# EAGLE schematic ArmazCape - Rev B3 (EAGLE 7.5.0)

## Sheet 1 of 3
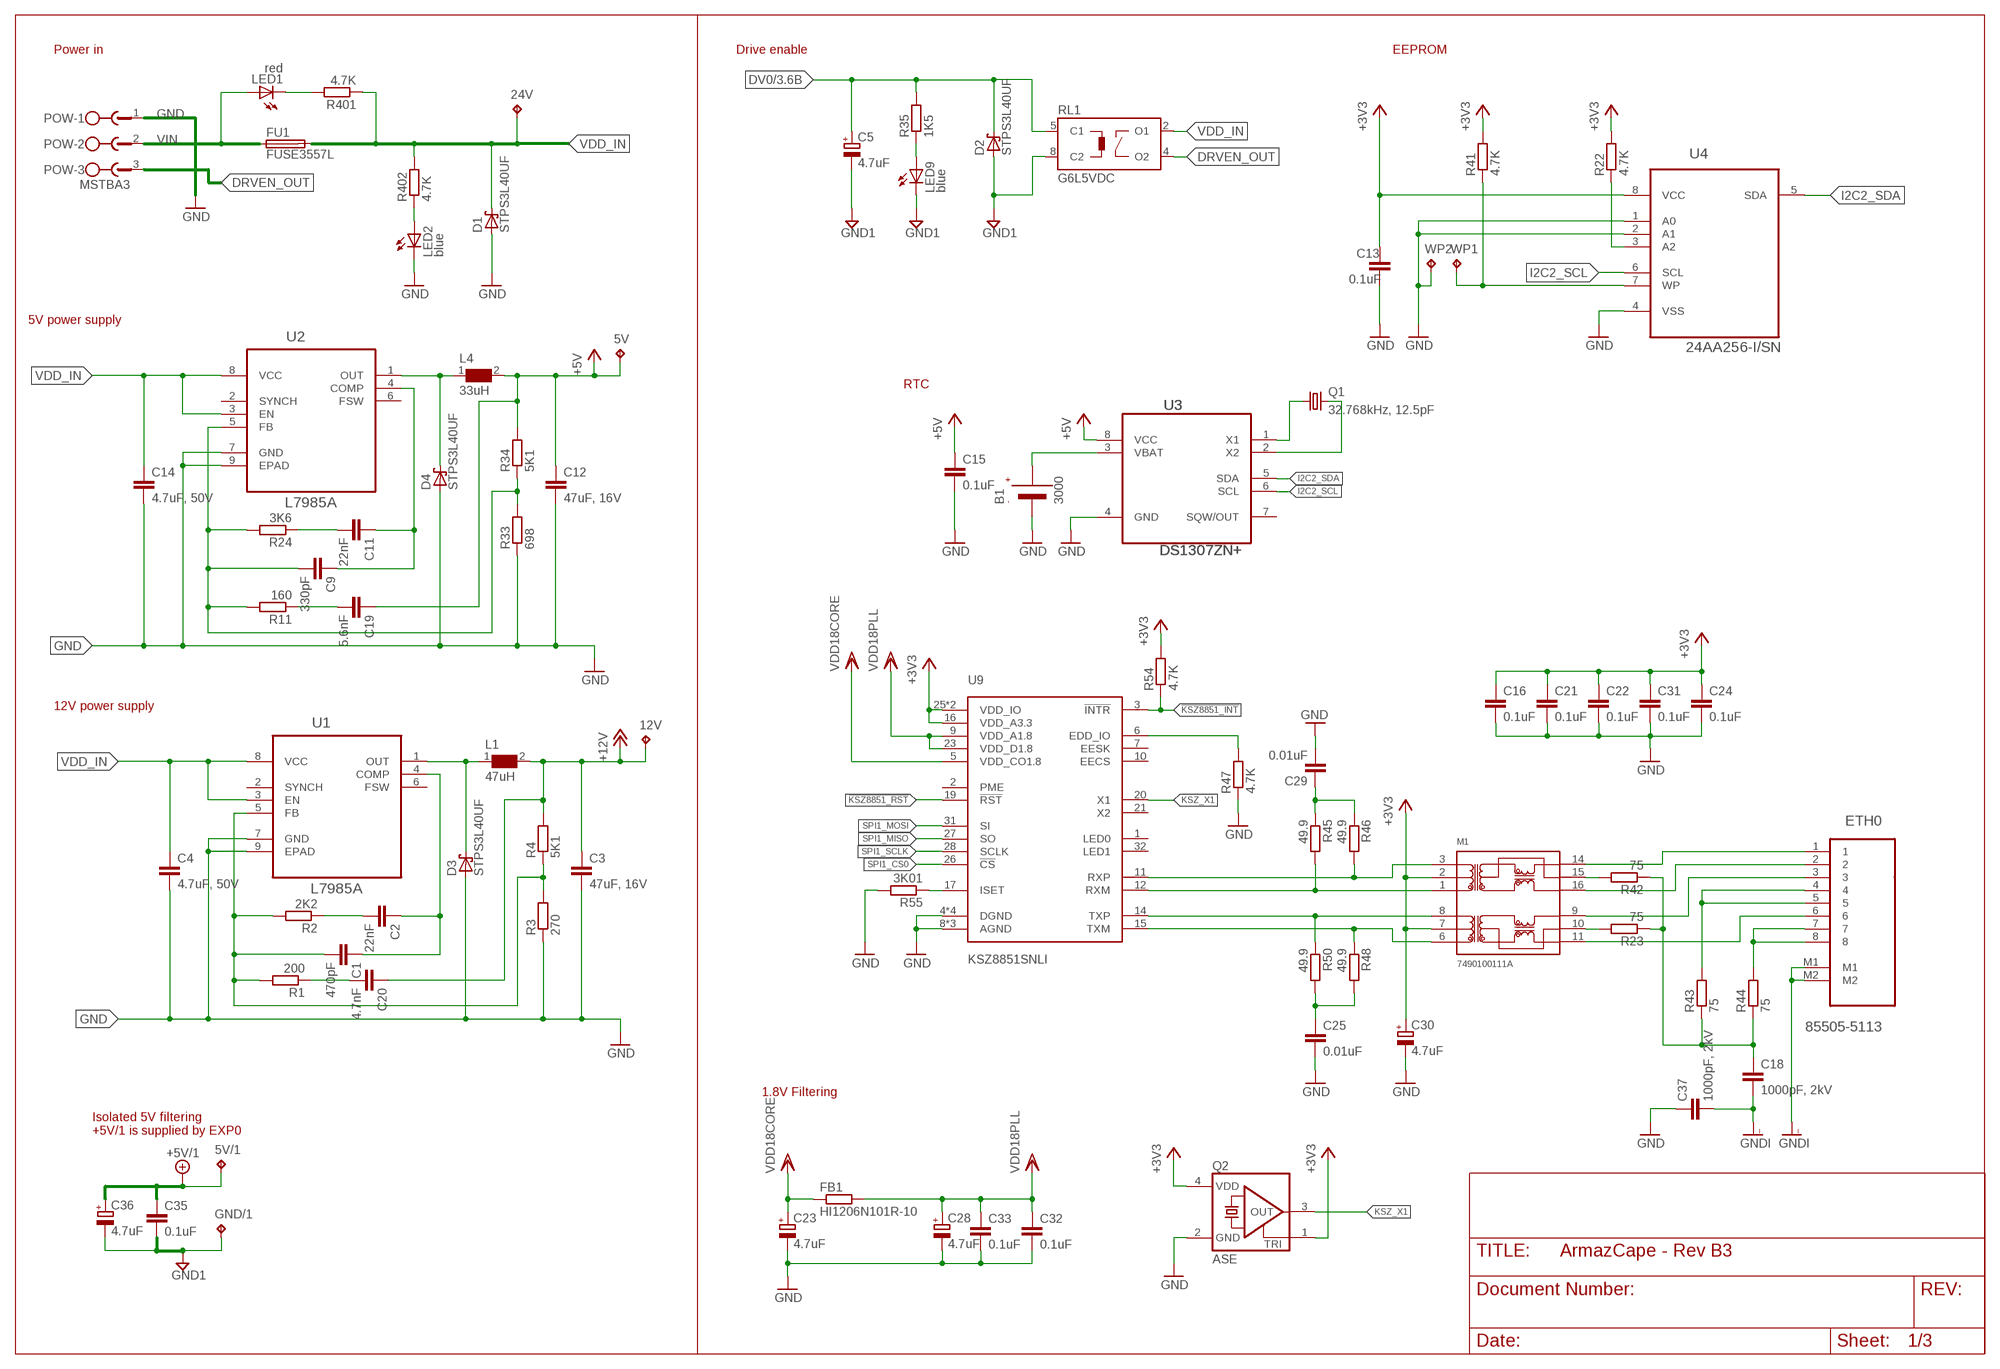
[diagram p0: schematic, sheet 1]

### Parts
5V  TPB1,27  [B1,27]
5V/1  TPB1,27  [B1,27]
12V  TPB1,27  [B1,27]
24V  TPB1,27  [B1,27]
B1  3000  [3000]
C1  470pF  C-EUC0603  [C0603]
C2  22nF  C-EUC0603  [C0603]
C3  47uF, 16V  C-EUC1210  [C1210]
C4  4.7uF, 50V  C-EUC1210  [C1210]
C5  4.7uF  CPOL-EUCT3216  [CT3216]
C9  330pF  C-EUC0603  [C0603]
C11  22nF  C-EUC0603  [C0603]
C12  47uF, 16V  C-EUC1210  [C1210]
C13  0.1uF  C-EUC0603  [C0603]
C14  4.7uF, 50V  C-EUC1210  [C1210]
C15  0.1uF  C-EUC0603  [C0603]
C16  0.1uF  C-EUC0603  [C0603]
C18  1000pF, 2kV  C-EUC1206  [C1206]
C19  5.6nF  C-EUC0603  [C0603]
C20  4.7nF  C-EUC0603  [C0603]
C21  0.1uF  C-EUC0603  [C0603]
C22  0.1uF  C-EUC0603  [C0603]
C23  4.7uF  CPOL-EUCT3216  [CT3216]
C24  0.1uF  C-EUC0603  [C0603]
C25  0.01uF  C-EUC0603  [C0603]
C28  4.7uF  CPOL-EUCT3216  [CT3216]
C29  0.01uF  C-EUC0603  [C0603]
C30  4.7uF  CPOL-EUCT3216  [CT3216]
C31  0.1uF  C-EUC0603  [C0603]
C32  0.1uF  C-EUC0603  [C0603]
C33  0.1uF  C-EUC0603  [C0603]
C35  0.1uF  C-EUC0603  [C0603]
C36  4.7uF  CPOL-EUCT3216  [CT3216]
C37  1000pF, 2kV  C-EUC1206  [C1206]
D1  STPS3L40UF  [SMB]
D2  STPS3L40UF  [SMB]
D3  STPS3L40UF  [SMB]
D4  STPS3L40UF  [SMB]
ETH0  85505-5113  [MOLEX_85505-5113]
FB1  HI1206N101R-10  [1206]
FU1  FUSE3557L  [3557-LITTLE]
GND/1  TPB1,27  [B1,27]
L1  47uH  WE-PD-7447709470_1260/1245/1280/1210  [WE-PD_1260/1245/1280/1210]
L4  33uH  WE-PD-7447709330_1260/1245/1280/1210  [WE-PD_1260/1245/1280/1210]
LED1  red  LEDCHIP-LED0603  [CHIP-LED0603]
LED2  blue  LEDCHIP-LED0603  [CHIP-LED0603]
LED9  blue  LEDCHIP-LED0603  [CHIP-LED0603]
M1  7490100111A  [7490100]
POW  MSTBA3  [MSTBA3]
Q1  32.768kHz, 12.5pF  ABS07-32.768KHZ  [ABS07]
Q2  ASE  [ASE]
R1  200  R-EU_R0603  [R0603]
R2  2K2  R-EU_R0603  [R0603]
R3  270  R-EU_R0603  [R0603]
R4  5K1  R-EU_R0603  [R0603]
R11  160  R-EU_R0402  [R0402]
R22  4.7K  R-EU_R0603  [R0603]
R23  75  R-EU_R0603  [R0603]
R24  3K6  R-EU_R0603  [R0603]
R33  698  R-EU_R0603  [R0603]
R34  5K1  R-EU_R0603  [R0603]
R35  1K5  R-EU_R0603  [R0603]
R41  4.7K  R-EU_R0603  [R0603]
R42  75  R-EU_R0603  [R0603]
R43  75  R-EU_R0603  [R0603]
R44  75  R-EU_R0603  [R0603]
R45  49.9  R-EU_R0603  [R0603]
R46  49.9  R-EU_R0603  [R0603]
R47  4.7K  R-EU_R0603  [R0603]
R48  49.9  R-EU_R0603  [R0603]
R50  49.9  R-EU_R0603  [R0603]
R54  4.7K  R-EU_R0603  [R0603]
R55  3K01  R-EU_R0603  [R0603]
R401  4.7K  R-EU_R0603  [R0603]
R402  4.7K  R-EU_R0603  [R0603]
RL1  G6L5VDC  [G6L-1F]
U1  L7985A  [SOIC127P600X170-9N]
U2  L7985A  [SOIC127P600X170-9N]
U3  DS1307ZN+  MAXIM_DS1307ZN+  [MAXIM_SOIC127P600X175-8N]
U4  24AA256-I/SN  MICROCHIP_BY_ELEMENT14_BATCH_1_24AA256-I/SN  [MICROCHIP_BY_ELEMENT14_BATCH_1_SOIC127P600X175-8N]
U9  KSZ8851SNLI  [QFN50P500X500X85-32L]
WP1  TPB1,27  [B1,27]
WP2  TPB1,27  [B1,27]

### Nets
!KSZ8851_INT: R54.1 U9.3(!INTR) ; also sheet 2
!KSZ8851_RST: U9.19(!RST) ; also sheet 2
+3V3 [supply]: C13.1 C16.1 C21.1 C22.1 C24.1 C30.+ C31.1 M1.2(RXCTI) M1.7(TXCTI) Q2.1(TRI) Q2.4(VDD) R22.2 R41.2 R54.2 U4.8(VCC) U9.25(VDD_IO) U9.30(VDD_IO) ; also sheet 2,3
+5V [supply]: 5V.TP C12.1 C15.1 C19.1 L4.2 R34.2 U3.8(VCC) ; also sheet 2,3
+5V/1 [supply]: 5V/1.TP C35.1 C36.+ ; also sheet 3
+12V [supply]: 12V.TP C3.1 C20.1 L1.2 R4.2 ; also sheet 2,3
DRVEN_OUT [supply]: POW.3 RL1.4(O2)
DV0: C5.+ D2.C R35.2 RL1.5(C1) ; also sheet 3
GND [supply]: B1.-(VBAT-) C3.2 C4.2 C12.2 C13.2 C14.2 C15.2 C16.2 C21.2 C22.2 C23.- C24.2 C25.2 C28.- C29.2 C30.- C31.2 C32.2 C33.2 C37.1 D1.A D3.A D4.A LED2.C POW.1 Q2.2(GND) R3.1 R33.1 R47.1 R55.2 U1.7(GND) U1.9(EPAD) U2.7(GND) U2.9(EPAD) U3.4(GND) U4.1(A0) U4.2(A1) U4.4(VSS) U9.4(DGND) U9.8(AGND) U9.13(AGND) U9.18(AGND) U9.22(DGND) U9.24(DGND) U9.29(DGND) WP2.TP ; also sheet 2,3
GND1 [supply]: C5.- C35.2 C36.- D2.A GND/1.TP LED9.C RL1.8(C2) ; also sheet 3
GNDI [supply]: C18.2 C37.2 ETH0.M1 ETH0.M2
I2C2_SCL: U3.6(SCL) U4.6(SCL) ; also sheet 2,3
I2C2_SDA: U3.5(SDA) U4.5(SDA) ; also sheet 2,3
KSZ_X1: Q2.3(OUT) U9.20(X1)
N$1 [supply]: C1.2 R1.2 R2.2 R3.2 R4.1 U1.5(FB)
N$2: C2.2 R2.1
N$3: C1.1 C2.1 U1.4(COMP)
N$4: M1.3(RDIP) R46.2 U9.11(RXP)
N$6: ETH0.6 M1.11(TDOM)
N$7: LED9.A R35.1
N$8: LED1.C R401.2
N$19 [supply]: D4.C L4.1 U2.1(OUT)
N$21 [supply]: C9.2 R11.2 R24.2 R33.2 R34.1 U2.5(FB)
N$24: Q1.1 U3.1(X1)
N$26: Q1.2 U3.2(X2)
N$28: C11.2 R24.1
N$29: C9.1 C11.1 U2.4(COMP)
N$30 [supply]: D3.C L1.1 U1.1(OUT)
N$31: M1.1(RDIM) R45.2 U9.12(RXM)
N$32: C19.2 R11.1
N$33: C20.2 R1.1
N$34: R41.1 U4.7(WP) WP1.TP
N$35: R22.1 U4.3(A2)
N$36: M1.8(TDIP) R50.1 U9.14(TXP)
N$37: M1.6(TDIM) R48.1 U9.15(TXM)
N$38: R55.1 U9.17(ISET)
N$40: ETH0.1 M1.14(RXOP)
N$41: ETH0.2 M1.16(RDOM)
N$42: ETH0.3 M1.9(TDOP)
N$43: C25.1 R48.2 R50.2
N$44: M1.10(TXCTO) R23.2
N$45: M1.15(RXCTO) R42.2
N$46: ETH0.4 ETH0.5 R43.2
N$47: ETH0.7 ETH0.8 R44.2
N$48: C18.1 R23.1 R42.1 R43.1 R44.1
N$49: C29.1 R45.1 R46.1
N$52: R47.2 U9.6(EDD_IO)
N$96: LED2.A R402.1
SPI1_CS0: U9.26(!CS) ; also sheet 2
SPI1_MISO: U9.27(SO) ; also sheet 2
SPI1_MOSI: U9.31(SI) ; also sheet 2
SPI1_SCLK: U9.28(SCLK) ; also sheet 2
VBAT+ [supply]: B1.+1(VBAT+) B1.+2(VBAT+) U3.3(VBAT)
VDD18CORE: C23.+ FB1.1 U9.5(VDD_CO1.8)
VDD18PLL: C28.+ C32.1 C33.1 FB1.2 U9.9(VDD_A1.8) U9.23(VDD_D1.8)
VDD_IN [supply]: 24V.TP C4.1 C14.1 D1.C FU1.3 FU1.4 R401.1 R402.2 RL1.2(O1) U1.3(EN) U1.8(VCC) U2.3(EN) U2.8(VCC)
VIN [supply]: FU1.1 FU1.2 LED1.A POW.2
Unconnected: U1.2(SYNCH) U1.6(FSW) U2.2(SYNCH) U2.6(FSW) U3.7(SQW/OUT) U9.1(LED0) U9.2(PME) U9.7(EESK) U9.10(EECS) U9.21(X2) U9.32(LED1)

### Notes on the sheet
- Power in | Drive enable | EEPROM
- 5V power supply
- RTC
- 12V power supply
- 1.8V Filtering
- Isolated 5V filtering
  +5V/1 is supplied by EXP0

## Sheet 2 of 3
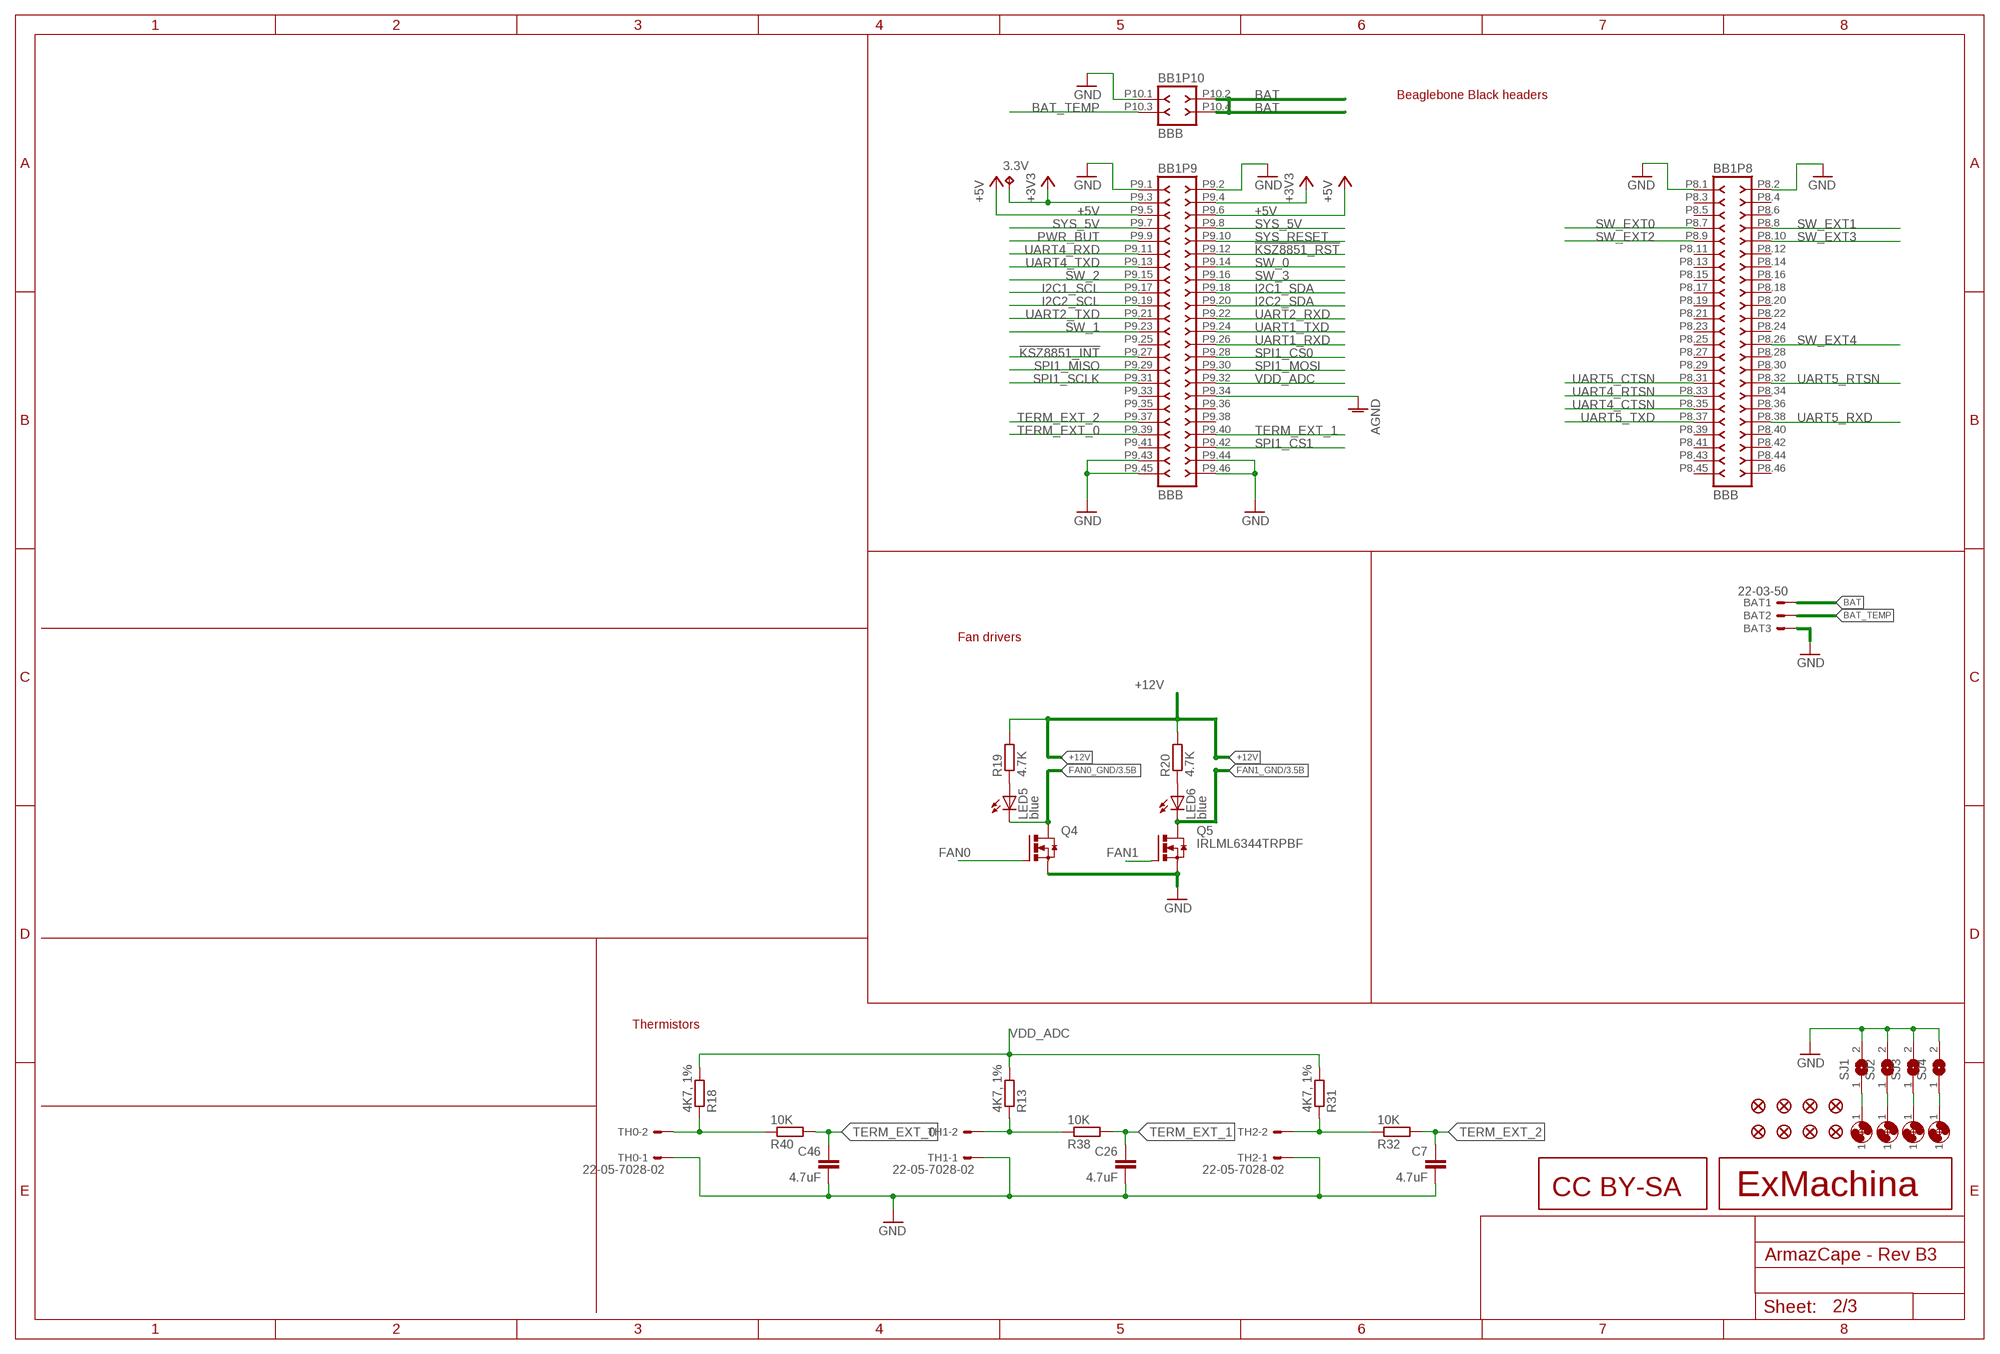
[diagram p1: schematic, sheet 2]

### Parts
3.3V  TPB1,27  [B1,27]
BAT  22-03-50  [5267-02A]
BB1  BBB  [BBB]
C7  4.7uF  C-EUC0603  [C0603]
C26  4.7uF  C-EUC0603  [C0603]
C46  4.7uF  C-EUC0603  [C0603]
FI1  FIDUCIAL1X2  [FIDUCIAL-1X2]
FI2  FIDUCIAL1X2  [FIDUCIAL-1X2]
FI3  FIDUCIAL1X2  [FIDUCIAL-1X2]
FI4  FIDUCIAL1X2  [FIDUCIAL-1X2]
FI5  FIDUCIAL1X2  [FIDUCIAL-1X2]
FI6  FIDUCIAL1X2  [FIDUCIAL-1X2]
FI7  FIDUCIAL1X2  [FIDUCIAL-1X2]
FI8  FIDUCIAL1X2  [FIDUCIAL-1X2]
H1  MOUNT-PAD3,0  [P3,0]
H2  MOUNT-PAD3,0  [P3,0]
H3  MOUNT-PAD3,0  [P3,0]
H4  MOUNT-PAD3,0  [P3,0]
LED5  blue  LEDCHIP-LED0603  [CHIP-LED0603]
LED6  blue  LEDCHIP-LED0603  [CHIP-LED0603]
Q4  IRLML6344TRPBF  [SOT95P240X112-3N]
Q5  IRLML6344TRPBF  [SOT95P240X112-3N]
R13  4K7, 1%  R-EU_R0603  [R0603]
R18  4K7, 1%  R-EU_R0603  [R0603]
R19  4.7K  R-EU_R0603  [R0603]
R20  4.7K  R-EU_R0603  [R0603]
R31  4K7, 1%  R-EU_R0603  [R0603]
R32  10K  R-EU_R0603  [R0603]
R38  10K  R-EU_R0603  [R0603]
R40  10K  R-EU_R0603  [R0603]
SJ1  SJ  [SJ]
SJ2  SJ  [SJ]
SJ3  SJ  [SJ]
SJ4  SJ  [SJ]
TH0  22-05-7028-02  [7395-02]
TH1  22-05-7028-02  [7395-02]
TH2  22-05-7028-02  [7395-02]
U$1  EXMACHINA-LOGO-NAME  [EXM-LOGO-BASELINE]
U$2  CC-BY-SA  [CC-BY-SA]

### Nets
!KSZ8851_INT: BB1.P9.27 ; also sheet 1
!KSZ8851_RST: BB1.P9.12 ; also sheet 1
+3V3 [supply]: 3.3V.TP BB1.P9.3 BB1.P9.4 ; also sheet 1,3
+5V [supply]: BB1.P9.5 BB1.P9.6 ; also sheet 1,3
+12V [supply]: R19.2 R20.2 ; also sheet 1,3
AGND: BB1.P9.34
BAT [supply]: BAT.P1 BB1.P10.2 BB1.P10.4
BAT_TEMP: BAT.P2 BB1.P10.3
FAN0: Q4.1(G) ; also sheet 3
FAN0_GND [supply]: LED5.C Q4.3(D) ; also sheet 3
FAN1: Q5.1(G) ; also sheet 3
FAN1_GND [supply]: LED6.C Q5.3(D) ; also sheet 3
GND [supply]: BAT.P3 BB1.P8.1 BB1.P8.2 BB1.P9.1 BB1.P9.2 BB1.P9.43 BB1.P9.44 BB1.P9.45 BB1.P9.46 BB1.P10.1 C7.2 C26.2 C46.2 Q4.2(S) Q5.2(S) SJ1.2 SJ2.2 SJ3.2 SJ4.2 TH0.1 TH1.1 TH2.1 ; also sheet 1,3
I2C1_SCL: BB1.P9.17
I2C1_SDA: BB1.P9.18
I2C2_SCL: BB1.P9.19 ; also sheet 1,3
I2C2_SDA: BB1.P9.20 ; also sheet 1,3
N$9: LED5.A R19.1
N$25: R31.1 R32.1 TH2.2
N$101 [supply]: H4.1 SJ1.1
N$102 [supply]: H3.1 SJ2.1
N$103 [supply]: H2.1 SJ3.1
N$104 [supply]: H1.1 SJ4.1
N$117: LED6.A R20.1
N$237: R13.1 R38.1 TH1.2
N$240: R18.1 R40.1 TH0.2
PWR_BUT: BB1.P9.9
SPI1_CS0: BB1.P9.28 ; also sheet 1
SPI1_CS1: BB1.P9.42
SPI1_MISO: BB1.P9.29 ; also sheet 1
SPI1_MOSI: BB1.P9.30 ; also sheet 1
SPI1_SCLK: BB1.P9.31 ; also sheet 1
SW_0: BB1.P9.14 ; also sheet 3
SW_1: BB1.P9.23 ; also sheet 3
SW_2: BB1.P9.15 ; also sheet 3
SW_3: BB1.P9.16 ; also sheet 3
SW_EXT0: BB1.P8.7 ; also sheet 3
SW_EXT1: BB1.P8.8 ; also sheet 3
SW_EXT2: BB1.P8.9 ; also sheet 3
SW_EXT3: BB1.P8.10 ; also sheet 3
SW_EXT4: BB1.P8.26 ; also sheet 3
SYS_5V [supply]: BB1.P9.7 BB1.P9.8 ; also sheet 3
SYS_RESET: BB1.P9.10
TERM_EXT_0: BB1.P9.39 C46.1 R40.2
TERM_EXT_1: BB1.P9.40 C26.1 R38.2
TERM_EXT_2: BB1.P9.37 C7.1 R32.2
UART1_RXD: BB1.P9.26
UART1_TXD: BB1.P9.24
UART2_RXD: BB1.P9.22
UART2_TXD: BB1.P9.21
UART4_CTSN: BB1.P8.35
UART4_RTSN: BB1.P8.33
UART4_RXD: BB1.P9.11 ; also sheet 3
UART4_TXD: BB1.P9.13
UART5_CTSN: BB1.P8.31
UART5_RTSN: BB1.P8.32
UART5_RXD: BB1.P8.38 ; also sheet 3
UART5_TXD: BB1.P8.37 ; also sheet 3
VDD_ADC: BB1.P9.32 R13.2 R18.2 R31.2
Unconnected: BB1.P8.3 BB1.P8.4 BB1.P8.5 BB1.P8.6 BB1.P8.11 BB1.P8.12 BB1.P8.13 BB1.P8.14 BB1.P8.15 BB1.P8.16 BB1.P8.17 BB1.P8.18 BB1.P8.19 BB1.P8.20 BB1.P8.21 BB1.P8.22 BB1.P8.23 BB1.P8.24 BB1.P8.25 BB1.P8.27 BB1.P8.28 BB1.P8.29 BB1.P8.30 BB1.P8.34 BB1.P8.36 BB1.P8.39 BB1.P8.40 BB1.P8.41 BB1.P8.42 BB1.P8.43 BB1.P8.44 BB1.P8.45 BB1.P8.46 BB1.P9.25 BB1.P9.33 BB1.P9.35 BB1.P9.36 BB1.P9.38 BB1.P9.41

### Notes on the sheet
- Beaglebone Black headers
- Fan drivers
- Thermistors

## Sheet 3 of 3
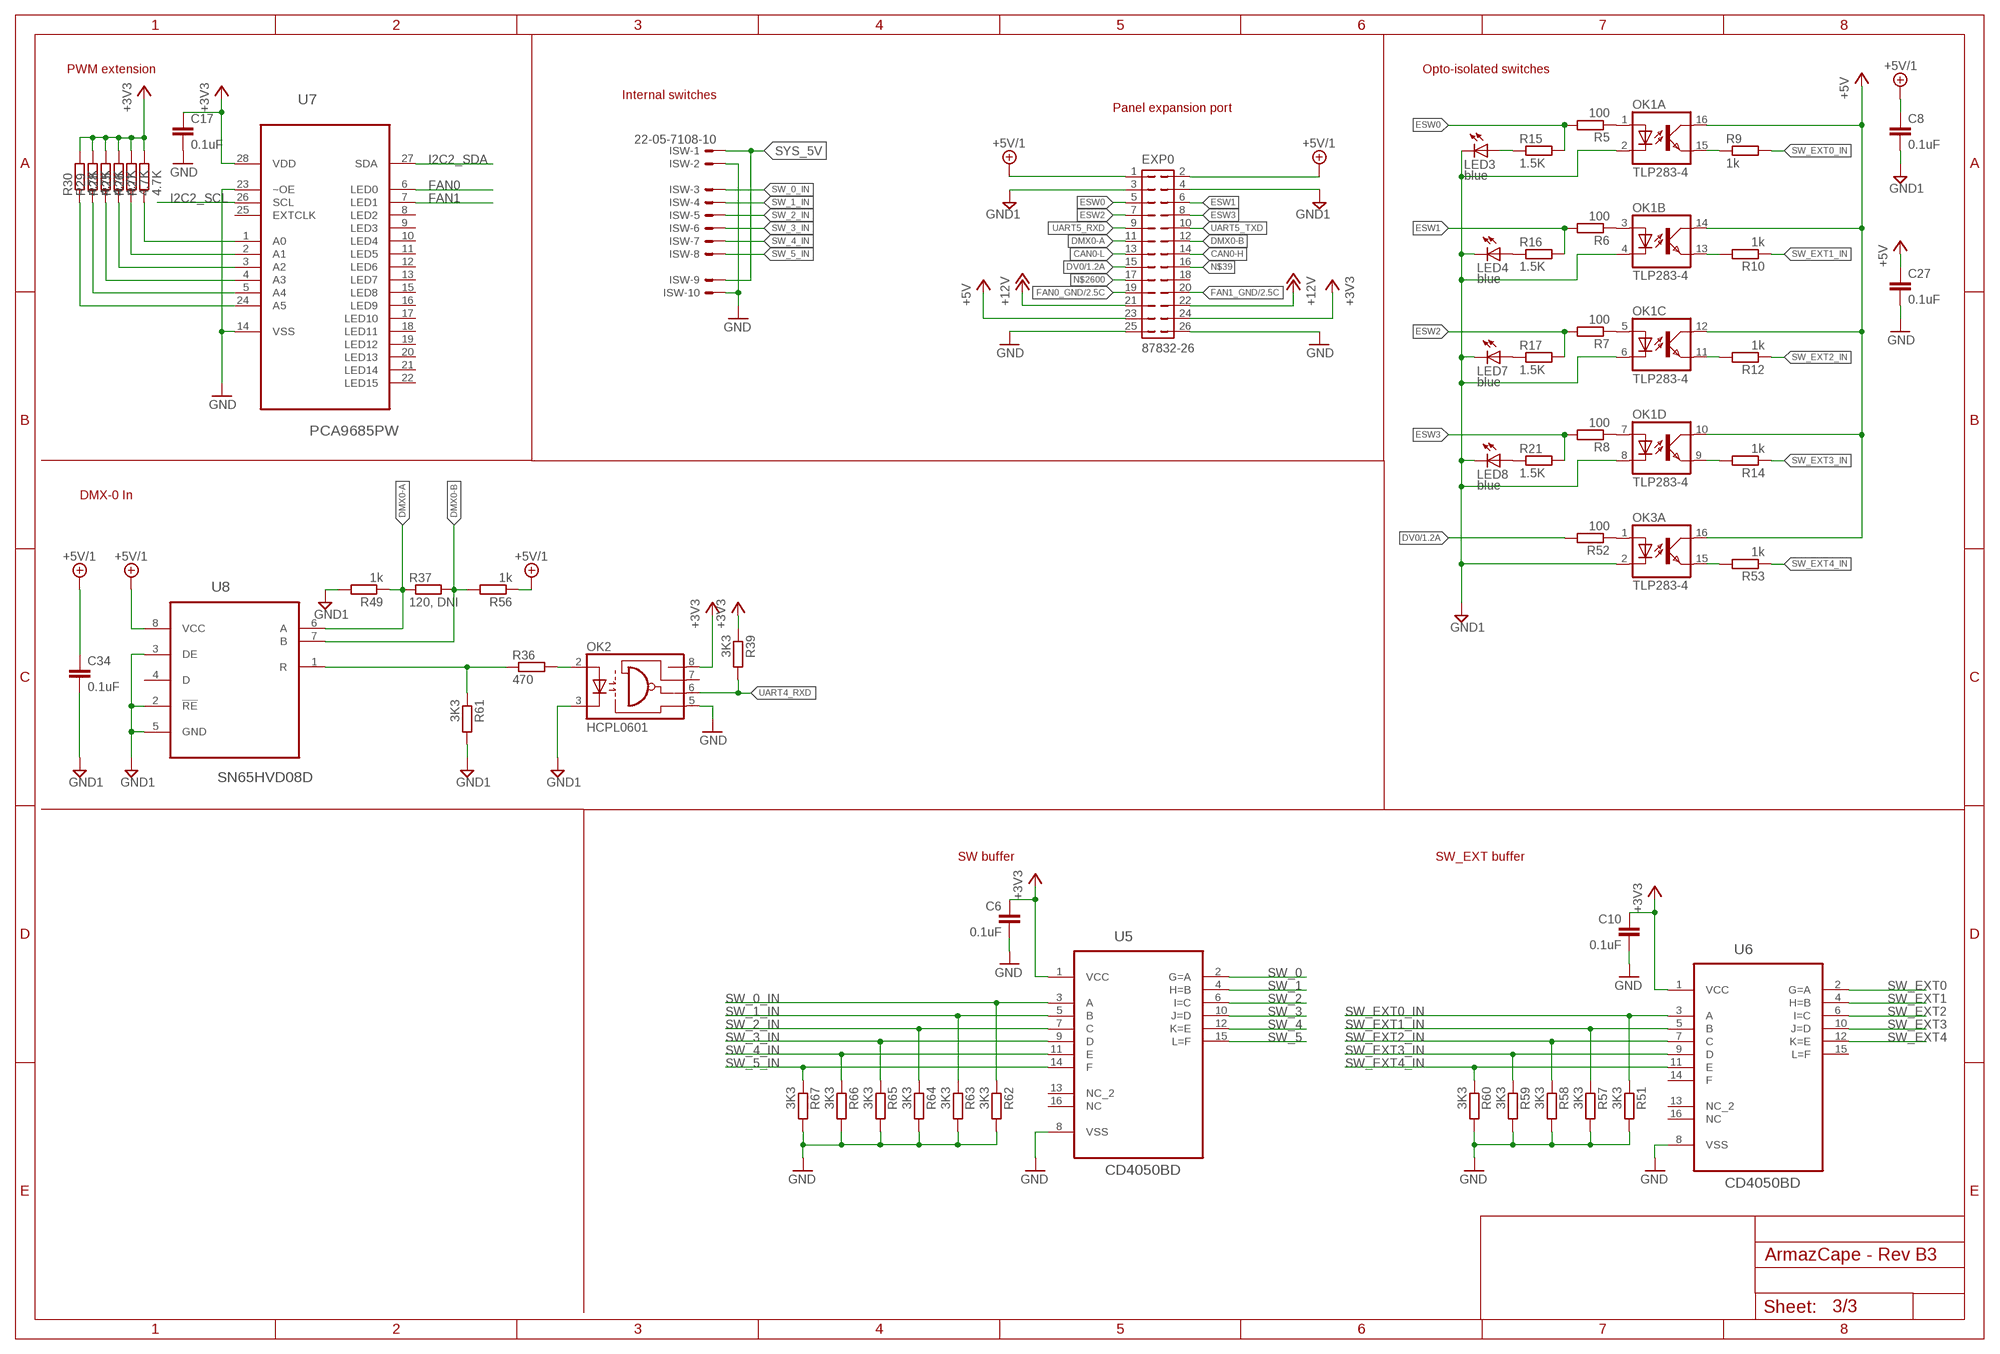
[diagram p2: schematic, sheet 3]

### Parts
C6  0.1uF  C-EUC0603  [C0603]
C8  0.1uF  C-EUC0603  [C0603]
C10  0.1uF  C-EUC0603  [C0603]
C17  0.1uF  C-EUC0603  [C0603]
C27  0.1uF  C-EUC0603  [C0603]
C34  0.1uF  C-EUC0603  [C0603]
EXP0  87832-26  [87832-26]
ISW  22-05-7108-10  [7395-10]
LED3  blue  LEDCHIP-LED0603  [CHIP-LED0603]
LED4  blue  LEDCHIP-LED0603  [CHIP-LED0603]
LED7  blue  LEDCHIP-LED0603  [CHIP-LED0603]
LED8  blue  LEDCHIP-LED0603  [CHIP-LED0603]
OK1  TLP283-4  [MINI-FLAT-16]
OK2  HCPL0601  [SOIC08]
OK3  TLP283-4  [MINI-FLAT-16]
R5  100  R-EU_R0603  [R0603]
R6  100  R-EU_R0603  [R0603]
R7  100  R-EU_R0603  [R0603]
R8  100  R-EU_R0603  [R0603]
R9  1k  R-EUR0603  [R0603]
R10  1k  R-EUR0603  [R0603]
R12  1k  R-EUR0603  [R0603]
R14  1k  R-EUR0603  [R0603]
R15  1.5K  R-EU_R0603  [R0603]
R16  1.5K  R-EU_R0603  [R0603]
R17  1.5K  R-EU_R0603  [R0603]
R21  1.5K  R-EU_R0603  [R0603]
R25  4.7K  R-EU_R0603  [R0603]
R26  4.7K  R-EU_R0603  [R0603]
R27  4.7K  R-EU_R0603  [R0603]
R28  4.7K  R-EU_R0603  [R0603]
R29  4.7K  R-EU_R0603  [R0603]
R30  4.7K  R-EU_R0603  [R0603]
R36  470  R-EU_R0603  [R0603]
R37  120, DNI  R-EU_R0603  [R0603]
R39  3K3  R-EU_R0603  [R0603]
R49  1k  R-EUR0603  [R0603]
R51  3K3  R-EU_R0603  [R0603]
R52  100  R-EU_R0603  [R0603]
R53  1k  R-EUR0603  [R0603]
R56  1k  R-EUR0603  [R0603]
R57  3K3  R-EU_R0603  [R0603]
R58  3K3  R-EU_R0603  [R0603]
R59  3K3  R-EU_R0603  [R0603]
R60  3K3  R-EU_R0603  [R0603]
R61  3K3  R-EU_R0603  [R0603]
R62  3K3  R-EU_R0603  [R0603]
R63  3K3  R-EU_R0603  [R0603]
R64  3K3  R-EU_R0603  [R0603]
R65  3K3  R-EU_R0603  [R0603]
R66  3K3  R-EU_R0603  [R0603]
R67  3K3  R-EU_R0603  [R0603]
U5  CD4050BD  [SOIC127P600X175-16N]
U6  CD4050BD  [SOIC127P600X175-16N]
U7  PCA9685PW  [SOP65P640X110-28N]
U8  SN65HVD08D  [SOIC127P600X175-8N]

### Nets
+3V3 [supply]: C6.1 C10.1 C17.1 EXP0.24 OK2.8(VCC) R25.2 R26.2 R27.2 R28.2 R29.2 R30.2 R39.1 U5.1(VCC) U6.1(VCC) U7.28(VDD) ; also sheet 1,2
+5V [supply]: C27.1 EXP0.23 OK1.10(D:COL) OK1.12(C:COL) OK1.14(B:COL) OK1.16(A:COL) OK3.16(A:COL) ; also sheet 1,2
+5V/1 [supply]: C8.1 C34.1 EXP0.1 EXP0.2 R56.1 U8.8(VCC) ; also sheet 1
+12V [supply]: EXP0.21 EXP0.22 ; also sheet 1,2
CAN0-H: EXP0.14
CAN0-L: EXP0.13
DMX0-A: EXP0.11 R37.1 R49.1 U8.6(A)
DMX0-B: EXP0.12 R37.2 R56.2 U8.7(B)
DV0: EXP0.15 R52.2 ; also sheet 1
ESW0: EXP0.5 R5.2 R15.2
ESW1: EXP0.6 R6.2 R16.2
ESW2: EXP0.7 R7.2 R17.2
ESW3: EXP0.8 R8.2 R21.2
FAN0: U7.6(LED0) ; also sheet 2
FAN0_GND [supply]: EXP0.19 ; also sheet 2
FAN1: U7.7(LED1) ; also sheet 2
FAN1_GND [supply]: EXP0.20 ; also sheet 2
GND [supply]: C6.2 C10.2 C17.2 C27.2 EXP0.25 EXP0.26 ISW.2 ISW.10 OK2.5(GND) R51.2 R57.2 R58.2 R59.2 R60.2 R62.2 R63.2 R64.2 R65.2 R66.2 R67.2 U5.8(VSS) U6.8(VSS) U7.14(VSS) U7.23(~OE) ; also sheet 1,2
GND1 [supply]: C8.2 C34.2 EXP0.3 EXP0.4 LED3.C LED4.C LED7.C LED8.C OK1.2(A:C) OK1.4(B:C) OK1.6(C:C) OK1.8(D:C) OK2.3(C) OK3.2(A:C) R49.2 R61.2 U8.2(!RE) U8.3(DE) U8.5(GND) ; also sheet 1
I2C2_SCL: U7.26(SCL) ; also sheet 1,2
I2C2_SDA: U7.27(SDA) ; also sheet 1,2
N$5 [supply]: OK2.2(A) R36.2
N$10: OK1.1(A:A) R5.1
N$11: OK1.15(A:EMIT) R9.1
N$12: OK1.7(D:A) R8.1
N$13: OK1.9(D:EMIT) R14.2
N$14: OK1.11(C:EMIT) R12.2
N$15: OK1.13(B:EMIT) R10.2
N$16: LED3.A R15.1
N$17: OK1.3(B:A) R6.1
N$18: LED4.A R16.1
N$20: LED7.A R17.1
N$22: LED8.A R21.1
N$23: OK1.5(C:A) R7.1
N$27: R36.1 R61.1 U8.1(R)
N$39: EXP0.16
N$53: OK3.1(A:A) R52.1
N$54: OK3.15(A:EMIT) R53.2
N$58: R27.1 U7.1(A0)
N$59: R26.1 U7.2(A1)
N$76: R25.1 U7.3(A2)
N$94: R28.1 U7.4(A3)
N$95: R29.1 U7.5(A4)
N$112: R30.1 U7.24(A5)
N$2600: EXP0.17
SW_0: U5.2(G=A) ; also sheet 2
SW_0_IN: ISW.3 R62.1 U5.3(A)
SW_1: U5.4(H=B) ; also sheet 2
SW_1_IN: ISW.4 R63.1 U5.5(B)
SW_2: U5.6(I=C) ; also sheet 2
SW_2_IN: ISW.5 R64.1 U5.7(C)
SW_3: U5.10(J=D) ; also sheet 2
SW_3_IN: ISW.6 R65.1 U5.9(D)
SW_4: U5.12(K=E)
SW_4_IN: ISW.7 R66.1 U5.11(E)
SW_5: U5.15(L=F)
SW_5_IN: ISW.8 R67.1 U5.14(F)
SW_EXT0: U6.2(G=A) ; also sheet 2
SW_EXT0_IN: R9.2 R51.1 U6.3(A)
SW_EXT1: U6.4(H=B) ; also sheet 2
SW_EXT1_IN: R10.1 R57.1 U6.5(B)
SW_EXT2: U6.6(I=C) ; also sheet 2
SW_EXT2_IN: R12.1 R58.1 U6.7(C)
SW_EXT3: U6.10(J=D) ; also sheet 2
SW_EXT3_IN: R14.1 R59.1 U6.9(D)
SW_EXT4: U6.12(K=E) ; also sheet 2
SW_EXT4_IN: R53.1 R60.1 U6.11(E)
SYS_5V [supply]: ISW.1 ISW.9 ; also sheet 2
UART4_RXD: OK2.6(VO) R39.2 ; also sheet 2
UART5_RXD: EXP0.9 ; also sheet 2
UART5_TXD: EXP0.10 ; also sheet 2
Unconnected: EXP0.18 OK2.7(VE) OK3.3(B:A) OK3.4(B:C) OK3.5(C:A) OK3.6(C:C) OK3.7(D:A) OK3.8(D:C) OK3.9(D:EMIT) OK3.10(D:COL) OK3.11(C:EMIT) OK3.12(C:COL) OK3.13(B:EMIT) OK3.14(B:COL) U5.13(NC_2) U5.16(NC) U6.13(NC_2) U6.14(F) U6.15(L=F) U6.16(NC) U7.8(LED2) U7.9(LED3) U7.10(LED4) U7.11(LED5) U7.12(LED6) U7.13(LED7) U7.15(LED8) U7.16(LED9) U7.17(LED10) U7.18(LED11) U7.19(LED12) U7.20(LED13) U7.21(LED14) U7.22(LED15) U7.25(EXTCLK) U8.4(D)

### Notes on the sheet
- PWM extension | Opto-isolated switches
- Internal switches
- Panel expansion port
- DMX-0 In
- SW buffer | SW_EXT buffer

## Power pins joined to a net without a drawn wire
VDD_A3.3: U9.16(VDD_A3.3)

## Library data of the parts
3.3V 5V 5V/1 12V 24V GND/1 WP1 WP2 = testpad:TP: Test pad; OC_FARNELL: unknown
B1 = keystone:3000; MF: KEYSTONE; MPN: 3000; OC_FARNELL: 1650692
BAT = con-molex:22-?-50; MF: MOLEX; MPN: 22-03-5035; OC_FARNELL: 9979620
BB1 = beaglebone:BBB; OC_FARNELL: unknown
C1 = rcl:C-EU: CAPACITOR, European symbol; MF: MURATA; MPN: GRM188R71H471KA01D; OC_FARNELL: 2494241
C2 C11 = rcl:C-EU: CAPACITOR, European symbol; MF: MURATA; MPN: GRM188R71E223KA01D; OC_FARNELL: 1828896
C3 C12 = rcl:C-EU: CAPACITOR, European symbol; MF: MURATA; MPN: GRM32ER61C476ME15L; OC_FARNELL: 1735538
C4 C14 = rcl:C-EU: CAPACITOR, European symbol; MF: MURATA; MPN: GRM32ER71H475KA88L; OC_FARNELL: 1828841
C5 C23 C28 C30 C36 = rcl:CPOL-EU: POLARIZED CAPACITOR, European symbol; MF: AVX (FORMERLY KNOWN AS NICHICON); MPN: F931A475MAA; OC_FARNELL: 1818579
C6 C8 C10 C13 C15-C17 C21 C22 C24 C27 C31-C35 = rcl:C-EU: CAPACITOR, European symbol; MF: MULTICOMP; MPN: MC0603B104K250CT; OC_FARNELL: 1759037
C7 C26 C46 = rcl:C-EU: CAPACITOR, European symbol; MF: MULTICOMP; MPN: MC0603X475K6R3CT; OC_FARNELL: 2320811
C9 = rcl:C-EU: CAPACITOR, European symbol; MF: MURATA; MPN: GRM1885C1H331JA01D; OC_FARNELL: 8819890
C18 C37 = rcl:C-EU: CAPACITOR, European symbol; MF: MULTICOMP; MPN: MC1206B102K202CT; OC_FARNELL: 1855909
C19 = rcl:C-EU: CAPACITOR, European symbol; MF: MULTICOMP; MPN: MC0603B562K500CT; OC_FARNELL: 1759099
C20 = rcl:C-EU: CAPACITOR, European symbol; MF: MURATA; MPN: GRM188R71H472KA01D; OC_FARNELL: 8819971
C25 C29 = rcl:C-EU: CAPACITOR, European symbol; MF: MULTICOMP; MPN: MC0603B103K160CT; OC_FARNELL: 1759003
D1-D4 = diode:STPS3L40?; MF: STMICROELECTRONICS; MP: STMICROELECTRONICS; MPN: STPS3L40UF; OC_FARNELL: 2341599
ETH0 = Molex-8550x-xxxx:85505-5113: CONNECTOR, RJ45, JACK, 8P8C, 1PORT, CAT5E; MF: MOLEX; MPN: 85505-5113; OC_FARNELL: 1560163; OC_NEWARK: 96M8715; PACKAGE: RJ45, JACK, 8P8C; SUPPLIER: Molex
EXP0 = con-molex:87832-26: Milli-Grid Header 2.00mm (.079") Pitch; MF: MOLEX; MPN: 87832-2620; OC_FARNELL: 2313712; OC_NEWARK: unknown
FB1 = emi_filter:HI?N101R-10; MC: LAIRD TECHNOLOGIES; MF: LAIRD TECHNOLOGIES; MPN: HI1206N101R-10; OC_FARNELL: 2292367
FI1-FI8 = SparkFun:FIDUCIAL: Fiducial Alignment Points Various fiducial points for machine vision alignment.; OC_FARNELL: unknown
FU1 = fuse2:FUSE: Fuse; MF: KEYSTONE; MPN: 3557; OC_FARNELL: 2292902
H1-H4 = holes:MOUNT-PAD: MOUNTING HOLE with drill center marker; OC_FARNELL: unknown
ISW = con-molex:22-?-10: CONNECTOR wire to board 2.54 mm (.1 inch) pitch header; MF: MOLEX; MPN: 22-05-7108; OC_FARNELL: 9731660; OC_NEWARK: unknown
L1 = WE-PD:WE-PD: SMD-Shielded Power Inductors WE-PD - Magnetically shielded version which results in a low leakage field - High storage capacity - Low self-losses - Highest possible current loading for SMD-Inducors -- Switching regulators with low operating voltages (computer, laptop, mobile phones, pagers) -- Integrated DC/DC-converter -- Is recommended for the application with switching regulators from National Semiconductor, Linear Technology, Texas Instruments and Fairchild Semiconductor, ect. -- Graphic cards -- Plastic base: Because of the one piece construction these are more suitable for high vibration or shock applications; MF: WURTH ELEKTRONIK; MPN: 7447709470; OC_FARNELL: 1635946; OC_NEWARK: 08P2777; PACKAGE: 1210; SUPPLIER: Wuerth Elektronik
L4 = WE-PD:WE-PD: SMD-Shielded Power Inductors WE-PD - Magnetically shielded version which results in a low leakage field - High storage capacity - Low self-losses - Highest possible current loading for SMD-Inducors -- Switching regulators with low operating voltages (computer, laptop, mobile phones, pagers) -- Integrated DC/DC-converter -- Is recommended for the application with switching regulators from National Semiconductor, Linear Technology, Texas Instruments and Fairchild Semiconductor, ect. -- Graphic cards -- Plastic base: Because of the one piece construction these are more suitable for high vibration or shock applications; MF: WURTH ELEKTRONIK; MPN: 7447709330; OC_FARNELL: 2082654; OC_NEWARK: 88T7077; PACKAGE: 1210; SUPPLIER: Wuerth Elektronik
LED1 = led:LED: LED OSRAM: - CHIPLED LG R971, LG N971, LY N971, LG Q971, LY Q971, LO R971, LY R971 LH N974, LH R974 LS Q976, LO Q976, LY Q976 LO Q996 - Hyper CHIPLED LW Q18S LB Q993, LB Q99A, LB R99A - SideLED LS A670, LO A670, LY A670, LG A670, LP A670 LB A673, LV A673, LT A673, LW A673 LH A674 LY A675 LS A676, LA A676, LO A676, LY A676, LW A676 LS A679, LY A679, LG A679 - Hyper Micro SIDELED® LS Y876, LA Y876, LO Y876, LY Y876 LT Y87S - SmartLED LW L88C, LW L88S LB L89C, LB L89S, LG L890 LS L89K, LO L89K, LY L89K LS L896, LA L896, LO L896, LY L896 - TOPLED LS T670, LO T670, LY T670, LG T670, LP T670 LSG T670, LSP T670, LSY T670, LOP T670, LYG T670 LG T671, LOG T671, LSG T671 LB T673, LV T673, LT T673, LW T673 LH T674 LS T676, LA T676, LO T676, LY T676, LB T676, LH T676, LSB T676, LW T676 LB T67C, LV T67C, LT T67C, LS T67K, LO T67K, LY T67K, LW E67C LS E67B, LA E67B, LO E67B, LY E67B, LB E67C, LV E67C, LT E67C LW T67C LS T679, LY T679, LG T679 LS T770, LO T770, LY T770, LG T770, LP T770 LB T773, LV T773, LT T773, LW T773 LH T774 LS E675, LA E675, LY E675, LS T675 LS T776, LA T776, LO T776, LY T776, LB T776 LHGB T686 LT T68C, LB T68C - Hyper Mini TOPLED® LB M676 - Mini TOPLED Santana® LG M470 LS M47K, LO M47K, LY M47K Source: http://www.osram.convergy.de LUXEON: - LUMILED® LXK2-PW12-R00, LXK2-PW12-S00, LXK2-PW14-U00, LXK2-PW14-V00 LXK2-PM12-R00, LXK2-PM12-S00, LXK2-PM14-U00 LXK2-PE12-Q00, LXK2-PE12-R00, LXK2-PE12-S00, LXK2-PE14-T00, LXK2-PE14-U00 LXK2-PB12-K00, LXK2-PB12-L00, LXK2-PB12-M00, LXK2-PB14-N00, LXK2-PB14-P00, LXK2-PB14-Q00 LXK2-PR12-L00, LXK2-PR12-M00, LXK2-PR14-Q00, LXK2-PR14-R00 LXK2-PD12-Q00, LXK2-PD12-R00, LXK2-PD12-S00 LXK2-PH12-R00, LXK2-PH12-S00 LXK2-PL12-P00, LXK2-PL12-Q00, LXK2-PL12-R00 Source: www.luxeon.com KINGBRIGHT: KA-3528ASYC Source: www.kingbright.com; MF: MULTICOMP; MPN: OVS-0608; OC_FARNELL: 1716774
LED2-LED9 = led:LED: LED OSRAM: - CHIPLED LG R971, LG N971, LY N971, LG Q971, LY Q971, LO R971, LY R971 LH N974, LH R974 LS Q976, LO Q976, LY Q976 LO Q996 - Hyper CHIPLED LW Q18S LB Q993, LB Q99A, LB R99A - SideLED LS A670, LO A670, LY A670, LG A670, LP A670 LB A673, LV A673, LT A673, LW A673 LH A674 LY A675 LS A676, LA A676, LO A676, LY A676, LW A676 LS A679, LY A679, LG A679 - Hyper Micro SIDELED® LS Y876, LA Y876, LO Y876, LY Y876 LT Y87S - SmartLED LW L88C, LW L88S LB L89C, LB L89S, LG L890 LS L89K, LO L89K, LY L89K LS L896, LA L896, LO L896, LY L896 - TOPLED LS T670, LO T670, LY T670, LG T670, LP T670 LSG T670, LSP T670, LSY T670, LOP T670, LYG T670 LG T671, LOG T671, LSG T671 LB T673, LV T673, LT T673, LW T673 LH T674 LS T676, LA T676, LO T676, LY T676, LB T676, LH T676, LSB T676, LW T676 LB T67C, LV T67C, LT T67C, LS T67K, LO T67K, LY T67K, LW E67C LS E67B, LA E67B, LO E67B, LY E67B, LB E67C, LV E67C, LT E67C LW T67C LS T679, LY T679, LG T679 LS T770, LO T770, LY T770, LG T770, LP T770 LB T773, LV T773, LT T773, LW T773 LH T774 LS E675, LA E675, LY E675, LS T675 LS T776, LA T776, LO T776, LY T776, LB T776 LHGB T686 LT T68C, LB T68C - Hyper Mini TOPLED® LB M676 - Mini TOPLED Santana® LG M470 LS M47K, LO M47K, LY M47K Source: http://www.osram.convergy.de LUXEON: - LUMILED® LXK2-PW12-R00, LXK2-PW12-S00, LXK2-PW14-U00, LXK2-PW14-V00 LXK2-PM12-R00, LXK2-PM12-S00, LXK2-PM14-U00 LXK2-PE12-Q00, LXK2-PE12-R00, LXK2-PE12-S00, LXK2-PE14-T00, LXK2-PE14-U00 LXK2-PB12-K00, LXK2-PB12-L00, LXK2-PB12-M00, LXK2-PB14-N00, LXK2-PB14-P00, LXK2-PB14-Q00 LXK2-PR12-L00, LXK2-PR12-M00, LXK2-PR14-Q00, LXK2-PR14-R00 LXK2-PD12-Q00, LXK2-PD12-R00, LXK2-PD12-S00 LXK2-PH12-R00, LXK2-PH12-S00 LXK2-PL12-P00, LXK2-PL12-Q00, LXK2-PL12-R00 Source: www.luxeon.com KINGBRIGHT: KA-3528ASYC Source: www.kingbright.com; MF: MULTICOMP; MPN: OVS-0603; OC_FARNELL: 1716770
M1 = wurth_elektronik:7490100?A; MF: WURTH ELEKTRONIK; MPN: 7490100111A; OC_FARNELL: 2401059
OK1 OK3 = optocoupler:TLP283-4: TOSHIBA PHOTOCOUPLER GaAs IRED & PHOTO-TRANSISTOR Source: http://www.semicon.toshiba.co.jp/td/en/Opto/Photocoupler/en_20050928_TLP283_datasheet.pdf; MF: VISHAY; MPN: TCMT4100; OC_FARNELL: 1779650; OC_NEWARK: unknown
OK2 = optocoupler:HCPL0601: HEWLETT PACKARD OPTO COUPLER; MF: AVAGO TECHNOLOGIES; MPN: HCPL-0601-000E; OC_FARNELL: 9995102; OC_NEWARK: 88H7776
POW = con-phoenix-508:MSTBA3: PHOENIX; MF: PHOENIX CONTACT; MPN: 1757255; OC_FARNELL: 3705183; OC_NEWARK: 71C4162
Q1 = crystal:ABS07-?; MF: ABRACON; MPN: ABS07-32.768KHZ-T; OC_FARNELL: 2101347
Q2 = crystal:ASE: 3.3Vdc CMOS SMD CRYSTAL CLOCK OSCILLATOR SOurce: www.abracon.com; MF: ABRACON; MPN: ASE-25.000MHZ-LC-T; OC_FARNELL: 1836151; OC_NEWARK: unknown
Q4 Q5 = International_Rectifier_By_element14_Batch_1:IRLML6344TRPBF: Power MOSFET; MF: INTERNATIONAL RECTIFIER; MPN: IRLML6344TRPBF; OC_FARNELL: 1857299; OC_NEWARK: 25T5501; PACKAGE: SOT-23-3; SUPPLIER: INTERNATIONAL RECTIFIER
R1 = rcl:R-EU_: RESISTOR, European symbol; MF: MULTICOMP; MPN: MCMR06X2000FTL; OC_FARNELL: 2073417
R2 = rcl:R-EU_: RESISTOR, European symbol; MF: MULTICOMP; MPN: MCMR06X2201FTL; OC_FARNELL: 2073429
R3 = rcl:R-EU_: RESISTOR, European symbol; MF: MULTICOMP; MPN: MCMR06X2700FTL; OC_FARNELL: 2073451
R4 R34 = rcl:R-EU_: RESISTOR, European symbol; MF: MULTICOMP; MPN: MCMR06X5101FTL; OC_FARNELL: 2073522
R5-R8 R52 = rcl:R-EU_: RESISTOR, European symbol; MF: MULTICOMP; MPN: MCMR06X1000FTL; OC_FARNELL: 2073347
R9 R10 R12 R14 R49 R53 R56 = rcl-2:R-EU: RESISTOR, European symbol; MF: MULTICOMP; MPN: MCMR06X1001FTL; OC_FARNELL: 2073348
R11 = rcl:R-EU_: RESISTOR, European symbol; MF: MULTICOMP; MPN: MCMR04X1600FTL; OC_FARNELL: 2072668
R13 R18-R20 R22 R25-R31 R41 R47 R54 R401 R402 = rcl:R-EU_: RESISTOR, European symbol; MF: MULTICOMP; MPN: MCMR06X4701FTL; OC_FARNELL: 2073509
R15-R17 R21 R35 = rcl:R-EU_: RESISTOR, European symbol; MF: MULTICOMP; MPN: MCMR06X1501FTL; OC_FARNELL: 2073391
R23 R42-R44 = rcl:R-EU_: RESISTOR, European symbol; MF: MULTICOMP; MPN: MCMR06X750 JTL; OC_FARNELL: 2073569
R24 = rcl:R-EU_: RESISTOR, European symbol; MF: MULTICOMP; MPN: MCMR06X3601FTL; OC_FARNELL: 2073482
R32 R38 R40 = rcl:R-EU_: RESISTOR, European symbol; MF: MULTICOMP; MPN: MCMR06X1002FTL; OC_FARNELL: 2073349
R33 = rcl:R-EU_: RESISTOR, European symbol; MF: MULTICOMP; MPN: MCMR04X6980FTL; OC_FARNELL: 2073217
R36 = rcl:R-EU_: RESISTOR, European symbol; MF: MULTICOMP; MPN: MCMR06X4700FTL; OC_FARNELL: 2073508
R37 = rcl:R-EU_: RESISTOR, European symbol; MF: MULTICOMP; MPN: MCMR06X1200FTL; OC_FARNELL: 2073369
R39 R51 R57-R67 = rcl:R-EU_: RESISTOR, European symbol; MF: MULTICOMP; MPN: MC0063W060313K3; OC_FARNELL: 9331026
R45 R46 R48 R50 = rcl:R-EU_: RESISTOR, European symbol; MF: MULTICOMP; MPN: MCMR06X49R9FTL; OC_FARNELL: 2073520
R55 = rcl:R-EU_: RESISTOR, European symbol; MF: MULTICOMP; MPN: MCMR06X3011FTL; OC_FARNELL: 2073464
RL1 = rel-omron:G6L; MF: OMRON ELECTRONIC COMPONENTS; MPN: G6L1F5DC; OC_FARNELL: 2213840
SJ1-SJ4 = jumper:SJ: SMD solder JUMPER; OC_FARNELL: unknown
TH0 TH1 TH2 = con-molex:22-?-02: CONNECTOR wire to board 2.54 mm (.1 inch) pitch header; MF: MOLEX; MPN: 22-05-7028; OC_FARNELL: 9731601; OC_NEWARK: unknown
U1 U2 = stmicroelectronics:L7985A: BUCK, 4.5-38V, 2A, 1MHZ, 0.6-38V, 8HSOP; MF: STMICROELECTRONICS; MPN: L7985A; OC_FARNELL: 2311340; OC_NEWARK: 86W0520; PACKAGE: HSOP8; SUPPLIER: STMicroelectronics
U3 = ArmazCape - Rev B2:MAXIM_DS1307ZN+: 64 x 8, Serial, I2C Real-Time Clock; MF: MAXIM INTEGRATED PRODUCTS; MPN: DS1307ZN+; OC_FARNELL: 9725253; OC_NEWARK: 96K8872; PACKAGE: SOIC-8; SUPPLIER: Maxim
U4 = ArmazCape - Rev B2:MICROCHIP_BY_ELEMENT14_BATCH_1_24AA256-I/SN: EEPROM; MF: MICROCHIP; MPN: 24AA256-I/SN; OC_FARNELL: 1331295; OC_NEWARK: 92C6874; PACKAGE: SOIC-8; SUPPLIER: MICROCHIP
U5 U6 = ti:CD4050BD: CMOS Hex Buffer/Converters; MF: TEXAS INSTRUMENTS; MPN: CD4050BD; OC_FARNELL: 1740857; OC_NEWARK: 50R5062; PACKAGE: 16-SOIC; SUPPLIER: Texas Instruments
U7 = custom:PCA9685PW: 16-channel, 12-bit PWM Fm+ I2C-bus LED controller; MF: NXP; MPN: PCA9685PW; OC_FARNELL: 1854074; OC_NEWARK: 19T6398; PACKAGE: TSSOP-28; SUPPLIER: NXP
U8 = ti:SN65HVD08D: WIDE SUPPLY RANGE RS-485 TRANSCEIVER; MF: TEXAS INSTRUMENTS; MPN: SN65HVD08D; OC_FARNELL: 1212360; OC_NEWARK: 17M9320; PACKAGE: SOIC-8; SUPPLIER: Texas Instruments
U9 = Micrel_By_element14_Batch_1:KSZ8851SNL; MF: MICREL SEMICONDUCTOR; MPN: KSZ8851SNLI TR; OC_FARNELL: 1961911
U$1 = exmachina:EXMACHINA-LOGO; OC_FARNELL: unknown
U$2 = cc-by-sa:CC-BY-SA; OC_FARNELL: unknown

## Net classes
0 default: width 0.178 mm, drill 0.25 mm, clearance 0.102 mm
1 supply: width 0.406 mm, drill 0.35 mm, clearance 0.203 mm to class 0, clearance 0.02 mm